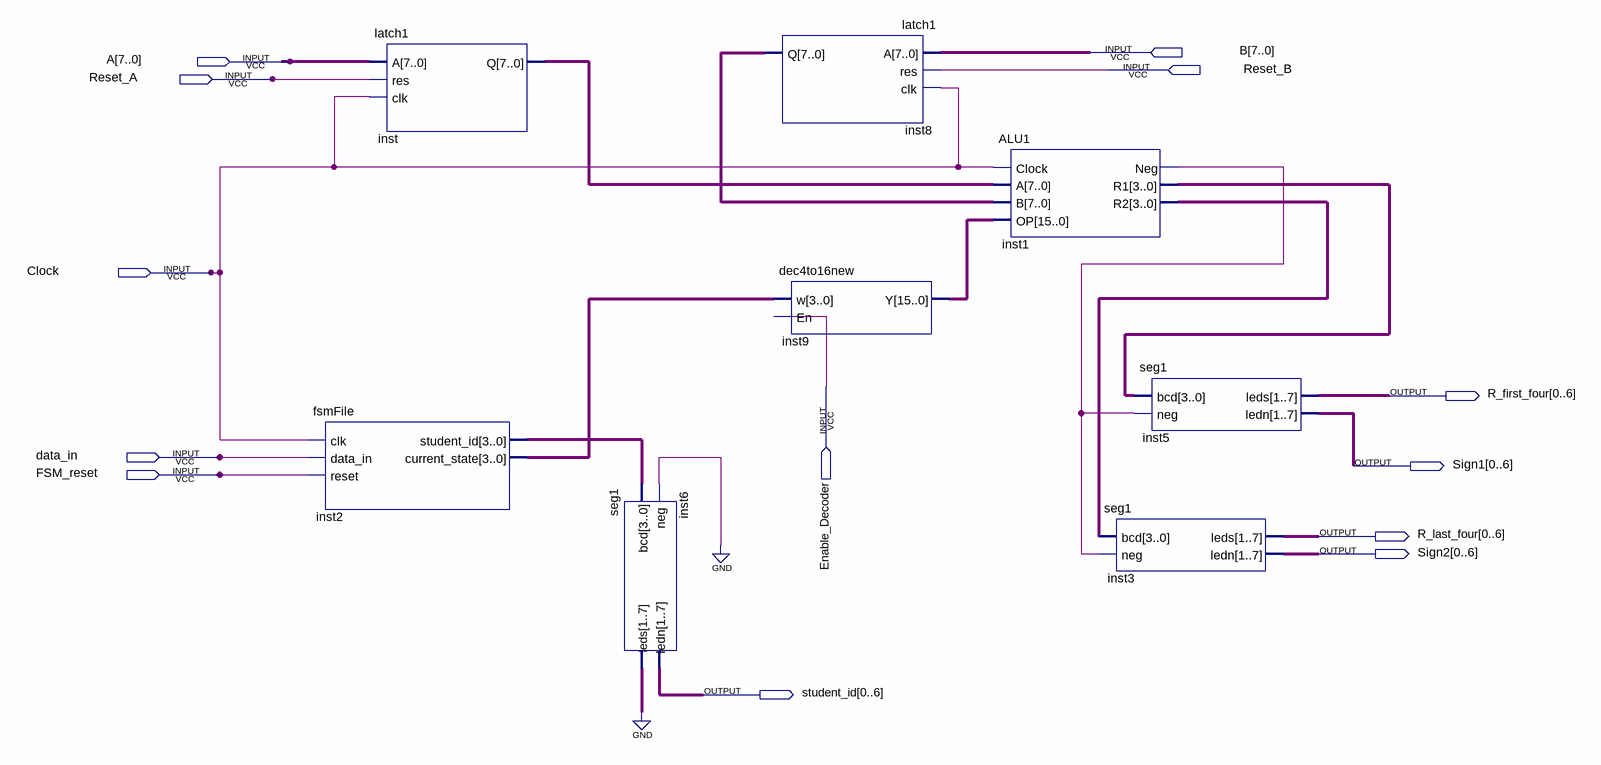
[diagram p0: schematic sheet]
// Quartus schematic lab6.bdf as structural Verilog: 8 symbols, 13 pins
module lab6 (
  input  [7:0] B,
  input  [7:0] A,
  input  Reset_B,
  input  Reset_A,
  input  Clock,
  input  Enable_Decoder,
  input  data_in,
  input  FSM_reset,
  output [0:6] R_first_four,
  output [0:6] Sign1,
  output [0:6] R_last_four,
  output [0:6] Sign2,
  output [0:6] student_id
);

  wire inst1_neg;
  wire [3:0] inst1_r1, inst1_r2, inst2_current_state, inst2_student_id;
  wire [6:0] inst6_leds;
  wire [7:0] inst8_q, inst_q;
  wire [15:0] inst9_y;

  fsmFile inst2 (
    .clk(Clock), .data_in(data_in), .reset(FSM_reset), .student_id(inst2_student_id),
    .current_state(inst2_current_state));
  latch1 inst (.A(A), .res(Reset_A), .clk(Clock), .Q(inst_q));
  seg1 inst6 (.bcd(inst2_student_id), .neg(1'b0), .leds(inst6_leds), .ledn(student_id));
  latch1 inst8 (.A(B), .res(Reset_B), .clk(Clock), .Q(inst8_q));
  dec4to16new inst9 (.w(inst2_current_state), .En(Enable_Decoder), .Y(inst9_y));
  ALU1 inst1 (.Clock(Clock), .A(inst_q), .B(inst8_q), .OP(inst9_y), .Neg(inst1_neg), .R1(inst1_r1), .R2(inst1_r2));
  seg1 inst3 (.bcd(inst1_r2), .neg(inst1_neg), .leds(R_last_four), .ledn(Sign2));
  seg1 inst5 (.bcd(inst1_r1), .neg(inst1_neg), .leds(R_first_four), .ledn(Sign1));
  // also tied to GND on the sheet: {inst6_leds[0], inst6_leds[1], inst6_leds[2], inst6_leds[3], inst6_leds[4], inst6_leds[5], inst6_leds[6]}
endmodule
